# Altium schematic sheet V1.0.SchDoc
size 101 x 50 mm
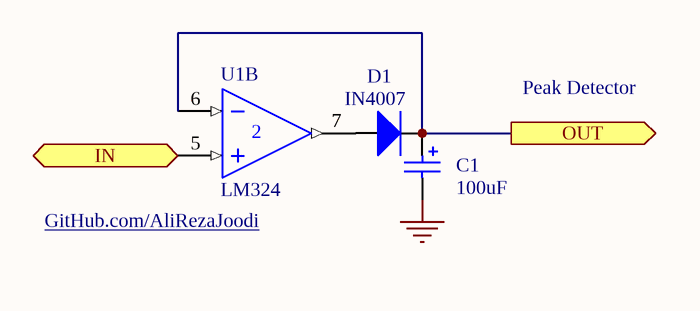
[diagram p0: V1.0.SchDoc]

## Parts
C1  100uF  [CAPPR2.5-6.3x5]
D1  IN4007  [DIODE-0.4]
U1  LM324  [646-06]  (part B of 5)

## Ports
IN (in), OUT (out)

## Nets
GND: C1.2
IN: U1.5(IN+) ; port IN
OUT: C1.1 D1.2(K) U1.6(IN-) ; port OUT
NetD1_1: D1.1(A) U1.7(OUT)

## Notes on the sheet
- Peak Detector
- (near U1) GitHub.com/AliRezaJoodi

## Library data of the parts
C1 = Cap Pol1: Polarized Capacitor (Radial); Manufacturer: Generic Components; Class I: Passive; Published: 8-Jun-2000; Revision: July-2002: Re-released for DXP Platform.; Publisher: Altium Limited; Class II: Capacitor
D1 = Diode: Default Diode; Manufacturer: Generic Components; Class I: Discrete; Class II: Diode - Switching; Published: 8-Jun-2000; Revision: July-2002: Re-released for DXP Platform.; Publisher: Altium Limited
U1 = LM324: Quad Low-Power Operational Amplifier; Published: 17-Jul-2002; LatestRevisionDate: 06-Jun-2005; LatestRevisionNote: Stylized 3D Model Added.; DatasheetVersion: 1988; PackageVersion: 1997; PackageReference: 646-06; Publisher: Altium Limited; PackageDescription: DIP; 14 Leads; Row Spacing 7.62 mm; Pitch 2.54 mm; ComponentLink1Description: Manufacturer Link; ComponentLink1URL: http://www.onsemi.com/site/products/parametrics/0,4446,251,00.html; ComponentLink2Description: Datasheet; ComponentLink2URL: http://www.onsemi.com/pub/Collateral/LM324-D.PDF